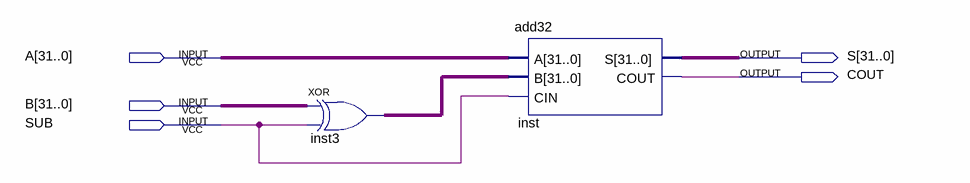
[diagram p0: schematic sheet]
// Quartus schematic AddSub32.bdf as structural Verilog: 2 symbols, 5 pins
module AddSub32 (
  input  [31:0] A,
  input  [31:0] B,
  input  SUB,
  output [31:0] S,
  output COUT
);

  wire [31:0] inst3_out;

  assign inst3_out = B ^ {32{SUB}};  // XOR inst3, 32 bits wide
  add32 inst (.A(A), .B(inst3_out), .CIN(SUB), .S(S), .COUT(COUT));
endmodule
